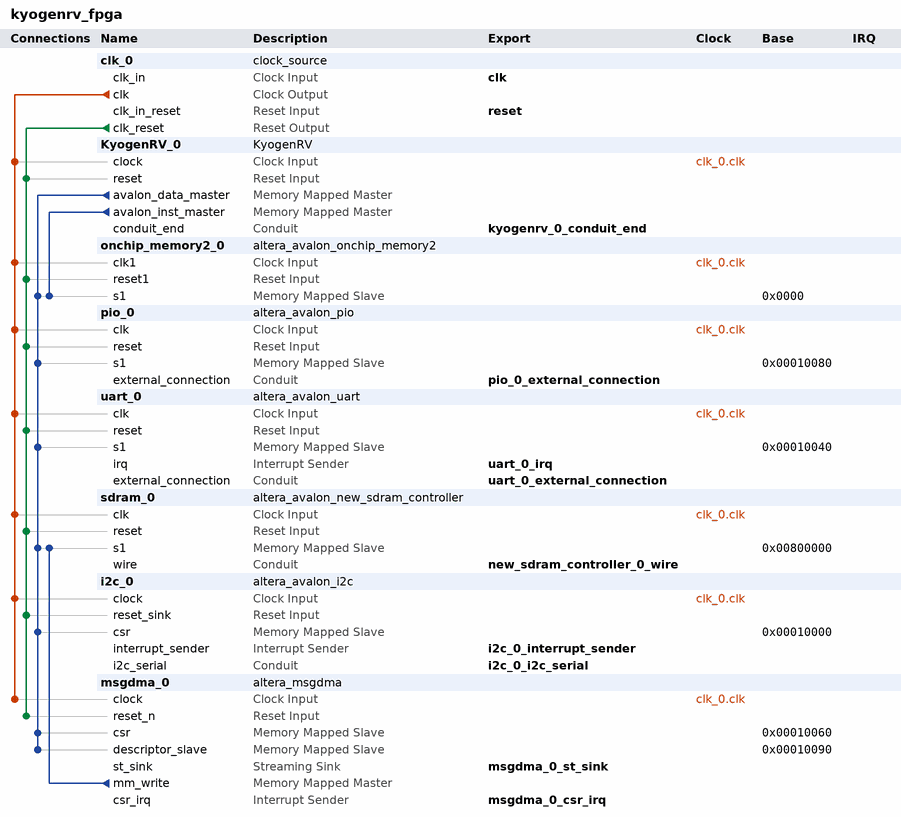
[diagram p0: system contents]
# Platform Designer (Qsys) system kyogenrv_fpga, Cyclone 10 LP 10CL025YU256C8G
# Parameters at their usual value, and those the tool derives, are not listed.
package require -exact qsys 20.1
create_system kyogenrv_fpga
set_project_property DEVICE_FAMILY {Cyclone 10 LP}
set_project_property DEVICE 10CL025YU256C8G

add_instance clk_0 clock_source 20.1
set_instance_parameter_value clk_0 clockFrequency 70000000

add_instance KyogenRV_0 KyogenRV 20.1

add_instance onchip_memory2_0 altera_avalon_onchip_memory2 20.1
set_instance_parameter_value onchip_memory2_0 dataWidth 32
set_instance_parameter_value onchip_memory2_0 dualPort false
set_instance_parameter_value onchip_memory2_0 initMemContent true
set_instance_parameter_value onchip_memory2_0 initializationFileName ./chisel_generated/blinker_intel.hex
set_instance_parameter_value onchip_memory2_0 memorySize 36864
set_instance_parameter_value onchip_memory2_0 singleClockOperation true
set_instance_parameter_value onchip_memory2_0 useNonDefaultInitFile true

add_instance pio_0 altera_avalon_pio 20.1
set_instance_parameter_value pio_0 direction Output
set_instance_parameter_value pio_0 width 8

add_instance uart_0 altera_avalon_uart 20.1
set_instance_parameter_value uart_0 baud 115200
set_instance_parameter_value uart_0 dataBits 8
set_instance_parameter_value uart_0 fixedBaud true
set_instance_parameter_value uart_0 parity NONE
set_instance_parameter_value uart_0 stopBits 1

add_instance sdram_0 altera_avalon_new_sdram_controller 20.1
set_instance_parameter_value sdram_0 TAC 5.5
set_instance_parameter_value sdram_0 TRCD 20.0
set_instance_parameter_value sdram_0 TRP 20.0
set_instance_parameter_value sdram_0 casLatency 3
set_instance_parameter_value sdram_0 columnWidth 8
set_instance_parameter_value sdram_0 dataWidth 16
set_instance_parameter_value sdram_0 generateSimulationModel false
set_instance_parameter_value sdram_0 model single_Micron_MT48LC4M32B2_7_chip
set_instance_parameter_value sdram_0 numberOfBanks 4
set_instance_parameter_value sdram_0 numberOfChipSelects 1
set_instance_parameter_value sdram_0 powerUpDelay 100.0
set_instance_parameter_value sdram_0 refreshPeriod 7.8125
set_instance_parameter_value sdram_0 rowWidth 12

add_instance i2c_0 altera_avalon_i2c 20.1
set_instance_parameter_value i2c_0 FIFO_DEPTH 4

add_instance msgdma_0 altera_msgdma 20.1
set_instance_parameter_value msgdma_0 BURST_ENABLE 0
set_instance_parameter_value msgdma_0 DATA_FIFO_DEPTH 32
set_instance_parameter_value msgdma_0 DATA_WIDTH 32
set_instance_parameter_value msgdma_0 DESCRIPTOR_FIFO_DEPTH 128
set_instance_parameter_value msgdma_0 ENHANCED_FEATURES 0
set_instance_parameter_value msgdma_0 ERROR_ENABLE 0
set_instance_parameter_value msgdma_0 MAX_BURST_COUNT 2
set_instance_parameter_value msgdma_0 MAX_BYTE 1024
set_instance_parameter_value msgdma_0 MODE 2
set_instance_parameter_value msgdma_0 PACKET_ENABLE 0
set_instance_parameter_value msgdma_0 TRANSFER_TYPE {Aligned Accesses}

# connections
add_connection clk_0.clk i2c_0.clock clock
add_connection clk_0.clk KyogenRV_0.clock clock
add_connection clk_0.clk msgdma_0.clock clock
add_connection clk_0.clk onchip_memory2_0.clk1 clock
add_connection clk_0.clk pio_0.clk clock
add_connection clk_0.clk sdram_0.clk clock
add_connection clk_0.clk uart_0.clk clock
add_connection clk_0.clk_reset i2c_0.reset_sink reset
add_connection clk_0.clk_reset KyogenRV_0.reset reset
add_connection clk_0.clk_reset msgdma_0.reset_n reset
add_connection clk_0.clk_reset onchip_memory2_0.reset1 reset
add_connection clk_0.clk_reset pio_0.reset reset
add_connection clk_0.clk_reset sdram_0.reset reset
add_connection clk_0.clk_reset uart_0.reset reset
add_connection KyogenRV_0.avalon_data_master i2c_0.csr avalon
set_connection_parameter_value KyogenRV_0.avalon_data_master/i2c_0.csr baseAddress 0x00010000
add_connection KyogenRV_0.avalon_data_master msgdma_0.csr avalon
set_connection_parameter_value KyogenRV_0.avalon_data_master/msgdma_0.csr baseAddress 0x00010060
add_connection KyogenRV_0.avalon_data_master msgdma_0.descriptor_slave avalon
set_connection_parameter_value KyogenRV_0.avalon_data_master/msgdma_0.descriptor_slave baseAddress 0x00010090
add_connection KyogenRV_0.avalon_data_master onchip_memory2_0.s1 avalon
set_connection_parameter_value KyogenRV_0.avalon_data_master/onchip_memory2_0.s1 arbitrationPriority 7
set_connection_parameter_value KyogenRV_0.avalon_data_master/onchip_memory2_0.s1 baseAddress 0x0000
add_connection KyogenRV_0.avalon_data_master pio_0.s1 avalon
set_connection_parameter_value KyogenRV_0.avalon_data_master/pio_0.s1 baseAddress 0x00010080
add_connection KyogenRV_0.avalon_data_master sdram_0.s1 avalon
set_connection_parameter_value KyogenRV_0.avalon_data_master/sdram_0.s1 baseAddress 0x00800000
add_connection KyogenRV_0.avalon_data_master uart_0.s1 avalon
set_connection_parameter_value KyogenRV_0.avalon_data_master/uart_0.s1 baseAddress 0x00010040
add_connection KyogenRV_0.avalon_inst_master onchip_memory2_0.s1 avalon
set_connection_parameter_value KyogenRV_0.avalon_inst_master/onchip_memory2_0.s1 arbitrationPriority 3
set_connection_parameter_value KyogenRV_0.avalon_inst_master/onchip_memory2_0.s1 baseAddress 0x0000
add_connection msgdma_0.mm_write sdram_0.s1 avalon
set_connection_parameter_value msgdma_0.mm_write/sdram_0.s1 baseAddress 0x00800000

# exported interfaces
add_interface clk clock sink
set_interface_property clk EXPORT_OF clk_0.clk_in
add_interface i2c_0_i2c_serial conduit end
set_interface_property i2c_0_i2c_serial EXPORT_OF i2c_0.i2c_serial
add_interface i2c_0_interrupt_sender interrupt sender
set_interface_property i2c_0_interrupt_sender EXPORT_OF i2c_0.interrupt_sender
add_interface kyogenrv_0_conduit_end conduit end
set_interface_property kyogenrv_0_conduit_end EXPORT_OF KyogenRV_0.conduit_end
add_interface msgdma_0_csr_irq interrupt sender
set_interface_property msgdma_0_csr_irq EXPORT_OF msgdma_0.csr_irq
add_interface msgdma_0_st_sink avalon_streaming sink
set_interface_property msgdma_0_st_sink EXPORT_OF msgdma_0.st_sink
add_interface new_sdram_controller_0_wire conduit end
set_interface_property new_sdram_controller_0_wire EXPORT_OF sdram_0.wire
add_interface pio_0_external_connection conduit end
set_interface_property pio_0_external_connection EXPORT_OF pio_0.external_connection
add_interface reset reset sink
set_interface_property reset EXPORT_OF clk_0.clk_in_reset
add_interface uart_0_external_connection conduit end
set_interface_property uart_0_external_connection EXPORT_OF uart_0.external_connection
add_interface uart_0_irq interrupt sender
set_interface_property uart_0_irq EXPORT_OF uart_0.irq

set_interconnect_requirement {$system} qsys_mm.clockCrossingAdapter HANDSHAKE
set_interconnect_requirement {$system} qsys_mm.enableEccProtection FALSE
set_interconnect_requirement {$system} qsys_mm.maxAdditionalLatency 1
set_interconnect_requirement onchip_memory2_0.s1 qsys_mm.arbitrationScheme fixed-priority

save_system kyogenrv_fpga.qsys
